# Altium schematic sheet Lora_receiver.SchDoc
size A
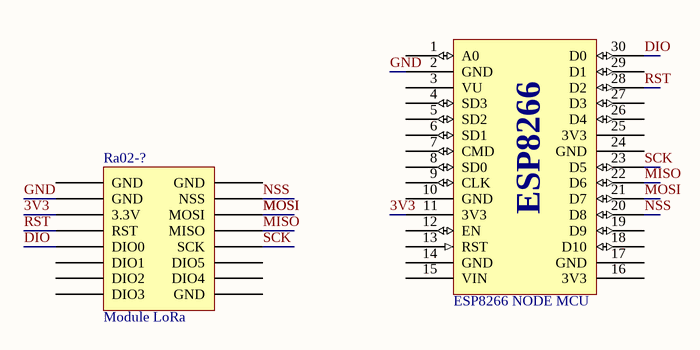
[diagram p0: Lora_receiver.SchDoc]

## Parts
?  ESP8266 NODE MCU  [ESP8266 NodeMCU]
Ra02-?  Module LoRa  [Module LoRa Ra02]

## Nets
3V3: ?.11(3V3) Ra02-?.3(3.3V)
DIO: ?.30(D0) Ra02-?.5(DIO0)
GND: ?.2(GND) Ra02-?.2(GND)
MISO: ?.22(D6) Ra02-?.13(MISO)
MOSI: ?.21(D7) Ra02-?.14(MOSI)
NSS: ?.20(D8) Ra02-?.15(NSS)
RST: ?.28(D2) Ra02-?.4(RST)
SCK: ?.23(D5) Ra02-?.12(SCK)

Not connected (* = marked no-connect by the designer): ? 1(A0) 3(VU) 4(SD3) 5(SD2) 6(SD1) 7(CMD) 8(SD0) 9(CLK) 10(GND) 12(EN) 13(RST) 14(GND) 15(VIN) 16(3V3) 17(GND) 18(D10) 19(D9) 24(GND) 25(3V3) 26(D4) 27(D3) 29(D1); Ra02-? 1(GND) 6(DIO1) 7(DIO2) 8(DIO3) 9(GND) 10(DIO4) 11(DIO5) 16(GND)

## Notes on the sheet
- (in symbol ESP8266 NodeMCU) ESP8266

## Library data of the parts
? = ESP8266 NodeMCU: LUA-ESP8266 Wifi Module Techmt.vn
Ra02-? = Module LoRa Ra02